# Altium schematic sheet Stepper_driver_group.SchDoc: STM32F446 CNC
size C; Author: AM; CompanyName: Expatria Technologies; DrawnBy: A.Marles; Engineer: AM; Organization: Expatria Technologies; DocumentNumber: 4; SheetNumber: 4; SheetTotal: 14
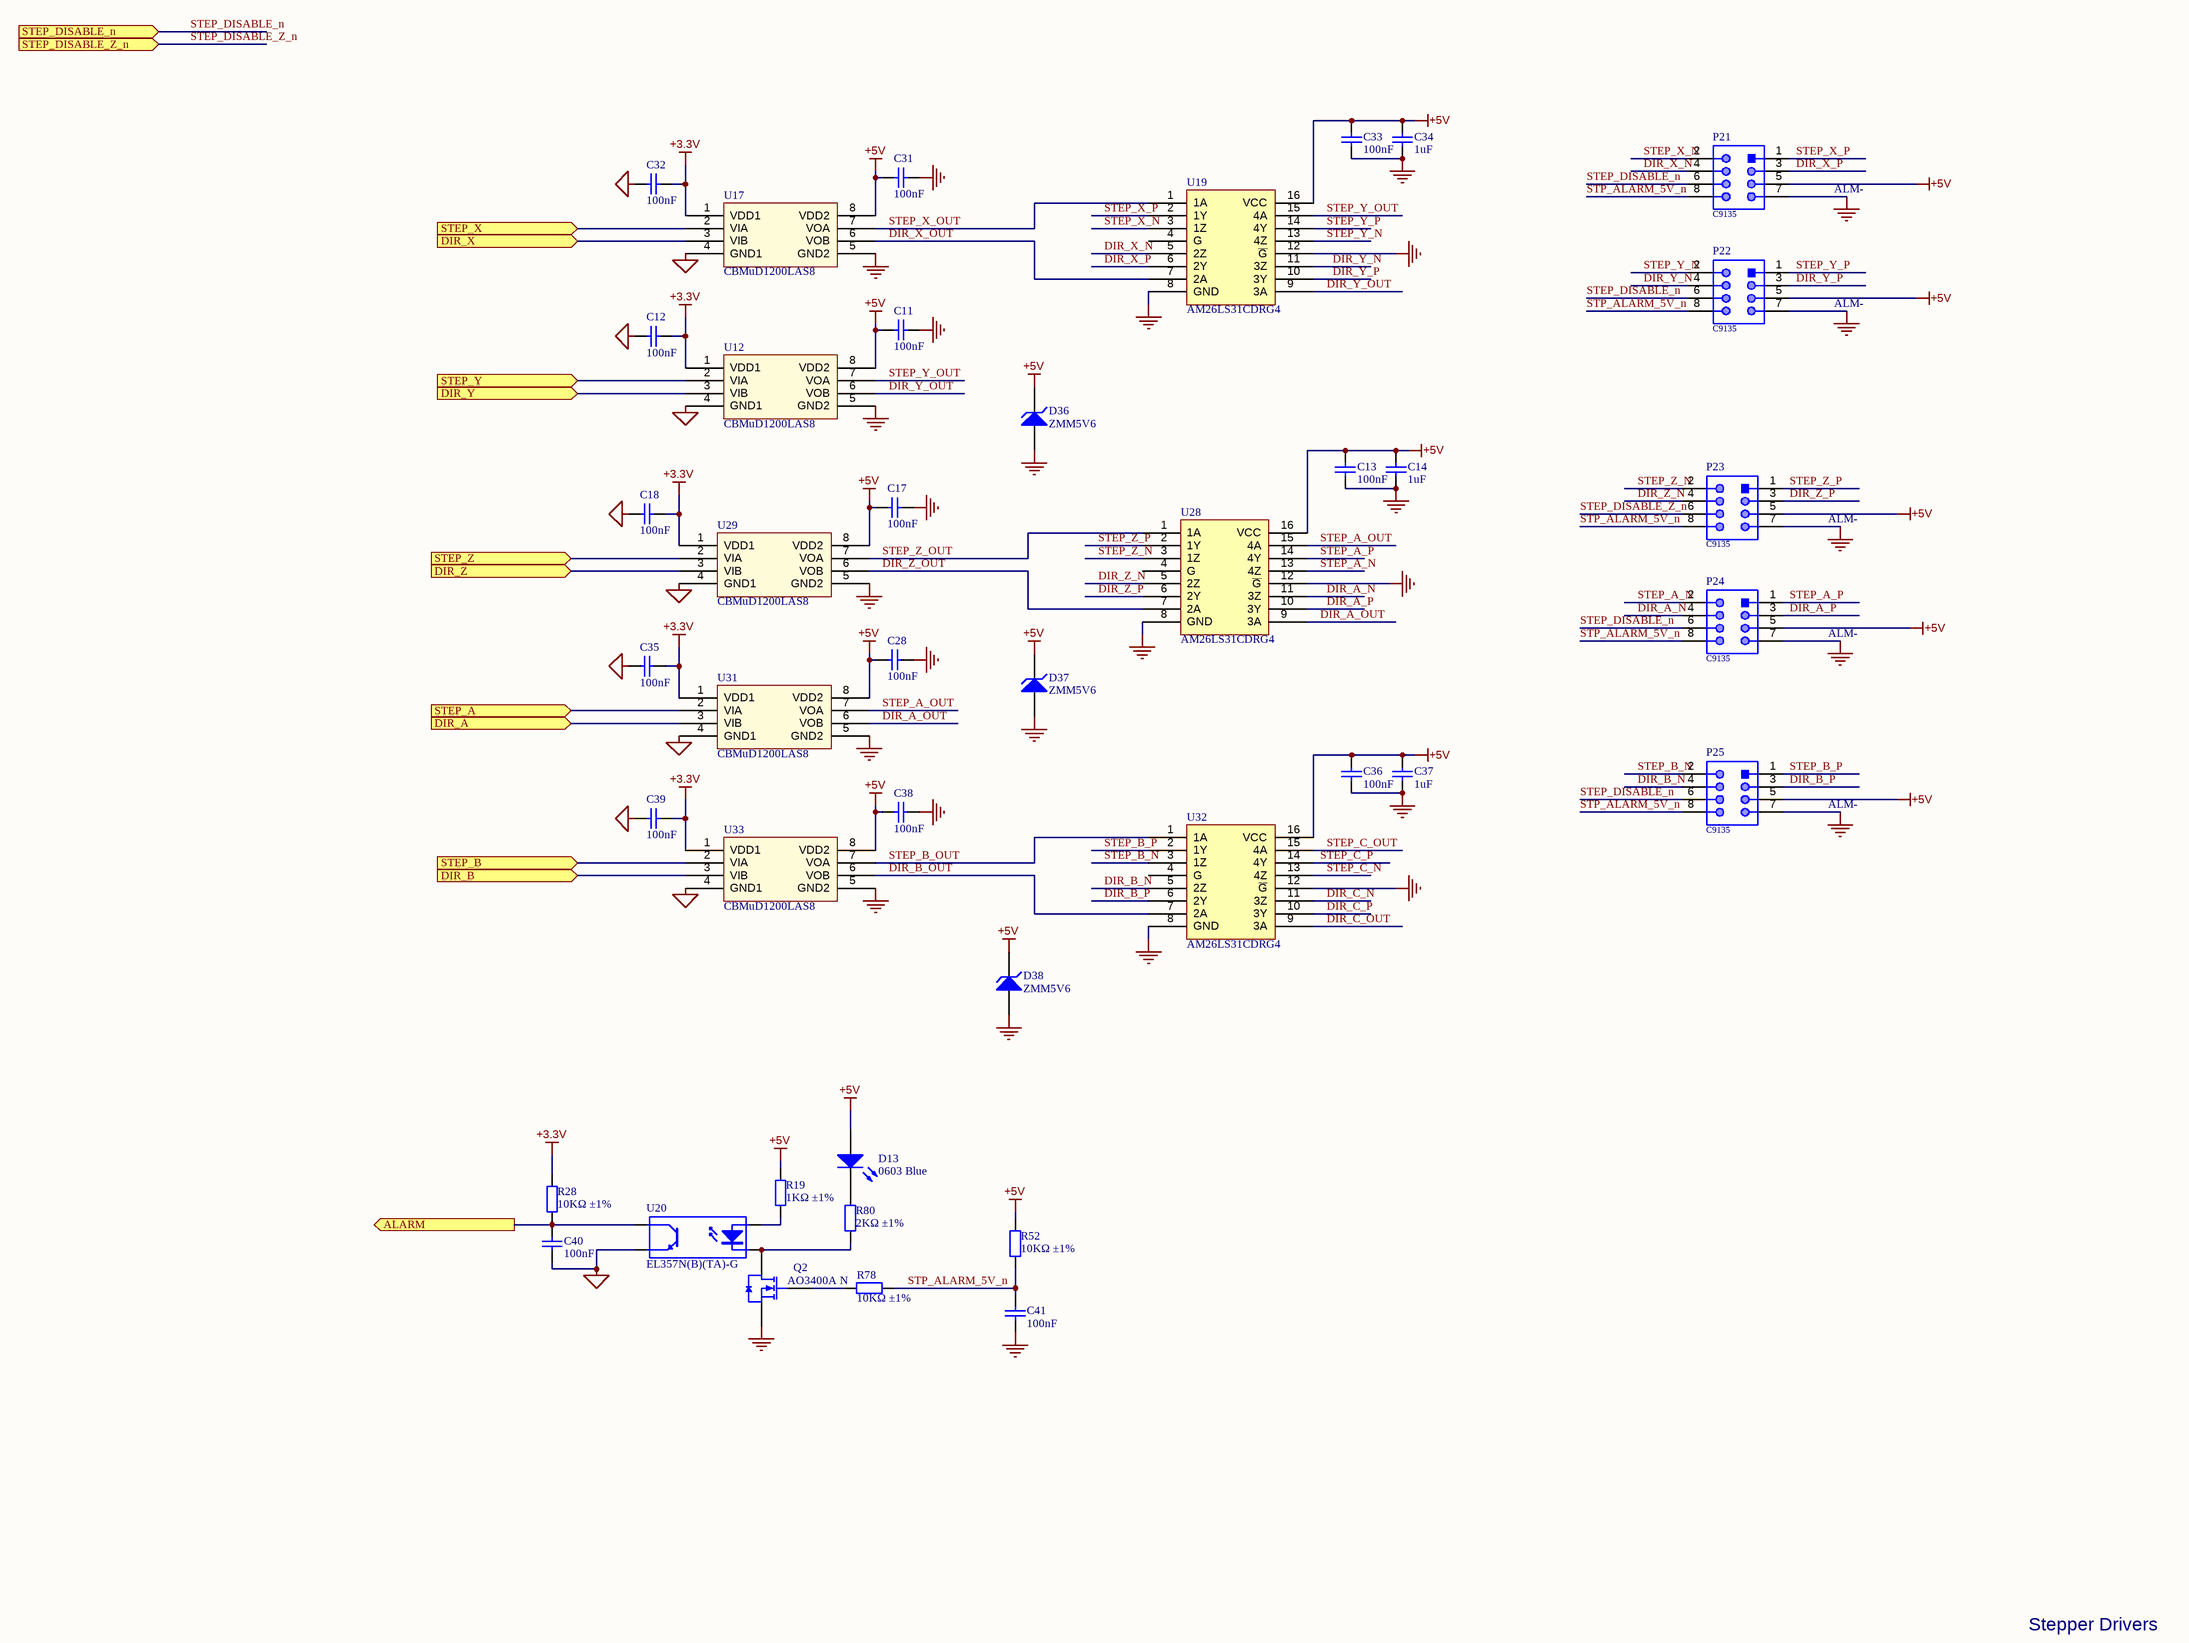
[diagram p0: Stepper_driver_group.SchDoc]

## Parts
C11  100nF  [0603_C]
C12  100nF  [0603_C]
C13  100nF  [0603_C]
C14  1uF  [0603_C]
C17  100nF  [0603_C]
C18  100nF  [0603_C]
C28  100nF  [0603_C]
C31  100nF  [0603_C]
C32  100nF  [0603_C]
C33  100nF  [0603_C]
C34  1uF  [0603_C]
C35  100nF  [0603_C]
C36  100nF  [0603_C]
C37  1uF  [0603_C]
C38  100nF  [0603_C]
C39  100nF  [0603_C]
C40  100nF  [0603_C]
C41  100nF  [0603_C]
D13  0603 Blue  [0603_LED_S1]
D36  ZMM5V6  [LL-34]
D37  ZMM5V6  [LL-34]
D38  ZMM5V6  [LL-34]
P21  C9135  [61200821621]
P22  C9135  [61200821621]
P23  C9135  [61200821621]
P24  C9135  [61200821621]
P25  C9135  [61200821621]
Q2  AO3400A N  [SOT-23-3L]
R19  1KΩ ±1%  [0603_R]
R28  10KΩ ±1%  [0603_R]
R52  10KΩ ±1%  [0603_R]
R78  10KΩ ±1%  [0603_R]
R80  2KΩ ±1%  [0603_R]
U12  CBMuD1200LAS8  [SOIC-8_150mil]
U17  CBMuD1200LAS8  [SOIC-8_150mil]
U19  AM26LS31CDRG4  [SOIC-16_150mil]
U20  EL357N(B)(TA)-G  [SOP-4_P2.54]
U28  AM26LS31CDRG4  [SOIC-16_150mil]
U29  CBMuD1200LAS8  [SOIC-8_150mil]
U31  CBMuD1200LAS8  [SOIC-8_150mil]
U32  AM26LS31CDRG4  [SOIC-16_150mil]
U33  CBMuD1200LAS8  [SOIC-8_150mil]

## Ports
ALARM (out), DIR_A (in), DIR_B (in), DIR_X (in), DIR_Y (in), DIR_Z (in), STEP_A (in), STEP_B (in), STEP_DISABLE_n (in), STEP_DISABLE_Z_n (in), STEP_X (in), STEP_Y (in), STEP_Z (in)

## Nets
+3.3V: C12.1 C18.1 C32.1 C35.1 C39.1 R28.2 U12.1(VDD1) U17.1(VDD1) U29.1(VDD1) U31.1(VDD1) U33.1(VDD1)
+5V: C11.2 C13.1 C14.1 C17.2 C28.2 C31.2 C33.1 C34.1 C36.1 C37.1 C38.2 D13.A D36.2(K) D37.2(K) D38.2(K) P21.5 P22.5 P23.5 P24.5 P25.5 R19.1 R52.2 U12.8(VDD2) U17.8(VDD2) U19.16(VCC) U28.16(VCC) U29.8(VDD2) U31.8(VDD2) U32.16(VCC) U33.8(VDD2)
GND: C11.1 C13.2 C14.2 C17.1 C28.1 C31.1 C33.2 C34.2 C36.2 C37.2 C38.1 C41.1 D36.1(A) D37.1(A) D38.1(A) P21.7 P22.7 P23.7 P24.7 P25.7 Q2.2(S) U12.5(GND2) U17.5(GND2) U19.8(GND) U19.12(~{G}) U28.8(GND) U28.12(~{G}) U29.5(GND2) U31.5(GND2) U32.8(GND) U32.12(~{G}) U33.5(GND2)
MCU_GND: C12.2 C18.2 C32.2 C35.2 C39.2 C40.1 U12.4(GND1) U17.4(GND1) U20.3(E) U29.4(GND1) U31.4(GND1) U33.4(GND1)
ALARM: C40.2 R28.1 U20.4(C) ; port ALARM
DIR_A: U31.3(VIB) ; port DIR_A
DIR_A_N: P24.4 U28.11(3Z)
DIR_A_OUT: U28.9(3A) U31.6(VOB)
DIR_A_P: P24.3 U28.10(3Y)
DIR_B: U33.3(VIB) ; port DIR_B
DIR_B_N: P25.4 U32.5(2Z)
DIR_B_OUT: U32.7(2A) U33.6(VOB)
DIR_B_P: P25.3 U32.6(2Y)
DIR_C_N: U32.11(3Z)
DIR_C_OUT: U32.9(3A)
DIR_C_P: U32.10(3Y)
DIR_X: U17.3(VIB) ; port DIR_X
DIR_X_N: P21.4 U19.5(2Z)
DIR_X_OUT: U17.6(VOB) U19.7(2A)
DIR_X_P: P21.3 U19.6(2Y)
DIR_Y: U12.3(VIB) ; port DIR_Y
DIR_Y_N: P22.4 U19.11(3Z)
DIR_Y_OUT: U12.6(VOB) U19.9(3A)
DIR_Y_P: P22.3 U19.10(3Y)
DIR_Z: U29.3(VIB) ; port DIR_Z
DIR_Z_N: P23.4 U28.5(2Z)
DIR_Z_OUT: U28.7(2A) U29.6(VOB)
DIR_Z_P: P23.3 U28.6(2Y)
STEP_A: U31.2(VIA) ; port STEP_A
STEP_A_N: P24.2 U28.13(4Z)
STEP_A_OUT: U28.15(4A) U31.7(VOA)
STEP_A_P: P24.1 U28.14(4Y)
STEP_B: U33.2(VIA) ; port STEP_B
STEP_B_N: P25.2 U32.3(1Z)
STEP_B_OUT: U32.1(1A) U33.7(VOA)
STEP_B_P: P25.1 U32.2(1Y)
STEP_C_N: U32.13(4Z)
STEP_C_OUT: U32.15(4A)
STEP_C_P: U32.14(4Y)
STEP_DISABLE_n: P21.6 P22.6 P24.6 P25.6 ; port STEP_DISABLE_n
STEP_DISABLE_Z_n: P23.6 ; port STEP_DISABLE_Z_n
STEP_X: U17.2(VIA) ; port STEP_X
STEP_X_N: P21.2 U19.3(1Z)
STEP_X_OUT: U17.7(VOA) U19.1(1A)
STEP_X_P: P21.1 U19.2(1Y)
STEP_Y: U12.2(VIA) ; port STEP_Y
STEP_Y_N: P22.2 U19.13(4Z)
STEP_Y_OUT: U12.7(VOA) U19.15(4A)
STEP_Y_P: P22.1 U19.14(4Y)
STEP_Z: U29.2(VIA) ; port STEP_Z
STEP_Z_N: P23.2 U28.3(1Z)
STEP_Z_OUT: U28.1(1A) U29.7(VOA)
STEP_Z_P: P23.1 U28.2(1Y)
STP_ALARM_5V_n: C41.2 P21.8 P22.8 P23.8 P24.8 P25.8 R52.1 R78.1
NetD13_K: D13.K R80.2
NetQ2_1: Q2.1(G) R78.2
NetQ2_3: Q2.3(D) R80.1 U20.2(K)
NetR19_2: R19.2 U20.1(A)

Not connected (* = marked no-connect by the designer): U19 4(G); U28 4(G); U32 4(G)

## Notes on the sheet
- (near P21) ALM-
- (near P22) ALM-
- (near P23) ALM-
- (near P24) ALM-
- (near P25) ALM-
- Stepper Drivers
- Expatria Technologies
- SHEET
- PROJECT
- REV
- 1136 Glade Court
- Port Coquitlam, BC V3B 1R5
- EMAIL: INFO@EXPATRIA.CA
- SIZE
- ENGR
- C
- MODIFIED
- DOCUMENT
- /
- Copyright Expatria Technologies 2022. This document describes Open Hardware and is licensed under the CERN-OHL-S v2. No warranty is implied or expressed.

## Library data of the parts
C11-C13 C17 C18 C28 C31-C33 C35 C36 C38-C41 = 0603 100nF (104) 10% 50V: Chip capacitors; Manufacturer: YAGEO; PartNumber: CC0603KRX7R9BB104; Tolerance: 10%; Voltage: 50V; ComponentLink1Description: Supplier link; ComponentLink1URL: http://www.szlcsc.com/product/details_15331.html; Package: 0603; Supplier: LC; SuppliersPartNumber: C14663; Capacitance: 100nF
C14 C34 C37 = 0603 1uF (105) 10% 50V: Chip capacitors; Manufacturer: Samsung Electro-Mechanics; PartNumber: CL10A105KB8NNNC; Tolerance: 10%; Voltage: 50V; ComponentLink1Description: Supplier link; ComponentLink1URL: http://www.szlcsc.com/product/details_16531.html; Package: 0603; Supplier: LC; SuppliersPartNumber: C15849; Capacitance: 1uF
D13 = 0603 LED Blue: LED; ComponentLink1Description: 供应商链接; ComponentLink1URL: http://www.szlcsc.com/product/details_73150.html; Package: 0603; Supplier: LC; SuppliersPartNumber: C72041; Color: Blue
D36-D38 = LL-34 ZMM5V6: 500mW - 0.1uA @ 1V 5.6V LL-34 Zener Diodes ROHS; ComponentLink1Description: 供应商链接; ComponentLink1URL: http://www.szlcsc.com/product/details_8541.html; Package: LL-34; Supplier: LC; SuppliersPartNumber: C8062
P21-P25 = CMP-1502-00006-1: Male Box Header WR-BHD, THT, Vertical, pitch 2.54 mm, 8 pins; Manufacturer: Wurth Elektronik; Pitch: 2.54mm; Publisher: WurthElektronik; Part Number: C9135; Packaging: Tray; Published Date: August2018; Package Reference: 61200821621; SuppliersPartNumber: C9135
Q2 = AO3400A N道沟 X0YV1T SOT-23: MOS(场效应管); ComponentLink1Description: 供应商链接; ComponentLink1URL: http://www.szlcsc.com/product/details_21629.html; Package: SOT-23; Supplier: LC; SuppliersPartNumber: C20917
R19 = 0603 1K (1001) 1%: Chip resistor; Manufacturer: Uniroyal Elec; PartNumber: 0603WAF1001T5E; Power: 1/10W; ComponentLink1Description: Supplier link; ComponentLink1URL: http://www.szlcsc.com/product/details_21904.html; Package: 0603; Supplier: LC; SuppliersPartNumber: C21190; Resistance: 1KΩ; Tolerance: 1%
R28 R52 R78 = 0603 10K (1002) 1%: Chip resistor; Manufacturer: Uniroyal Elec; PartNumber: 0603WAF1002T5E; Power: 1/10W; ComponentLink1Description: Supplier link; ComponentLink1URL: http://www.szlcsc.com/product/details_26547.html; Package: 0603; Supplier: LC; SuppliersPartNumber: C25804; Resistance: 10KΩ; Tolerance: 1%
R80 = 0603 2K (2001) 1%: Chip resistor; Manufacturer: Uniroyal Elec; PartNumber: 0603WAF2001T5E; Power: 1/10W; ComponentLink1Description: Supplier link; ComponentLink1URL: http://www.szlcsc.com/product/details_23702.html; Package: 0603; Supplier: LC; SuppliersPartNumber: C22975; Resistance: 2KΩ; Tolerance: 1%
U12 U17 U29 U31 U33 = CBMuD1200LAS8: Dual Channel Isolator; Package: SOIC-8_150mil; Supplier: LC; SuppliersPartNumber: C476470; ComponentLink1Description: 供应商链接; ComponentLink1URL: http://www.szlcsc.com/product/details_10199.html
U19 U28 U32 = AM26LS31CDRG4_[C6179]: 4/0 Driver - RS422, RS485 16-SOIC; Manufacturer 1: Texas Instruments; ComponentLink1Description: 供应商链接; ComponentLink1URL: http://www.szlcsc.com/product/details_6645.html; Package: SOIC-16_150mil; Supplier: LC; SuppliersPartNumber: C6179; Manufacturer Part Number 1: AM26LS31CDR
U20 = EL357N(B)(TA)-G_[C6649]: OPTOISOLATOR 3.75KV TRANS 4-SOP; Manufacturer 1: Everlight Elec; Package: SOP-4_P2.54; Supplier: LC; SuppliersPartNumber: C6649; Manufacturer Part Number 1: EL357N(B)(TA)-G